# Altium project 0020-03_FFT2G.PrjPcb (part 1 of 5)
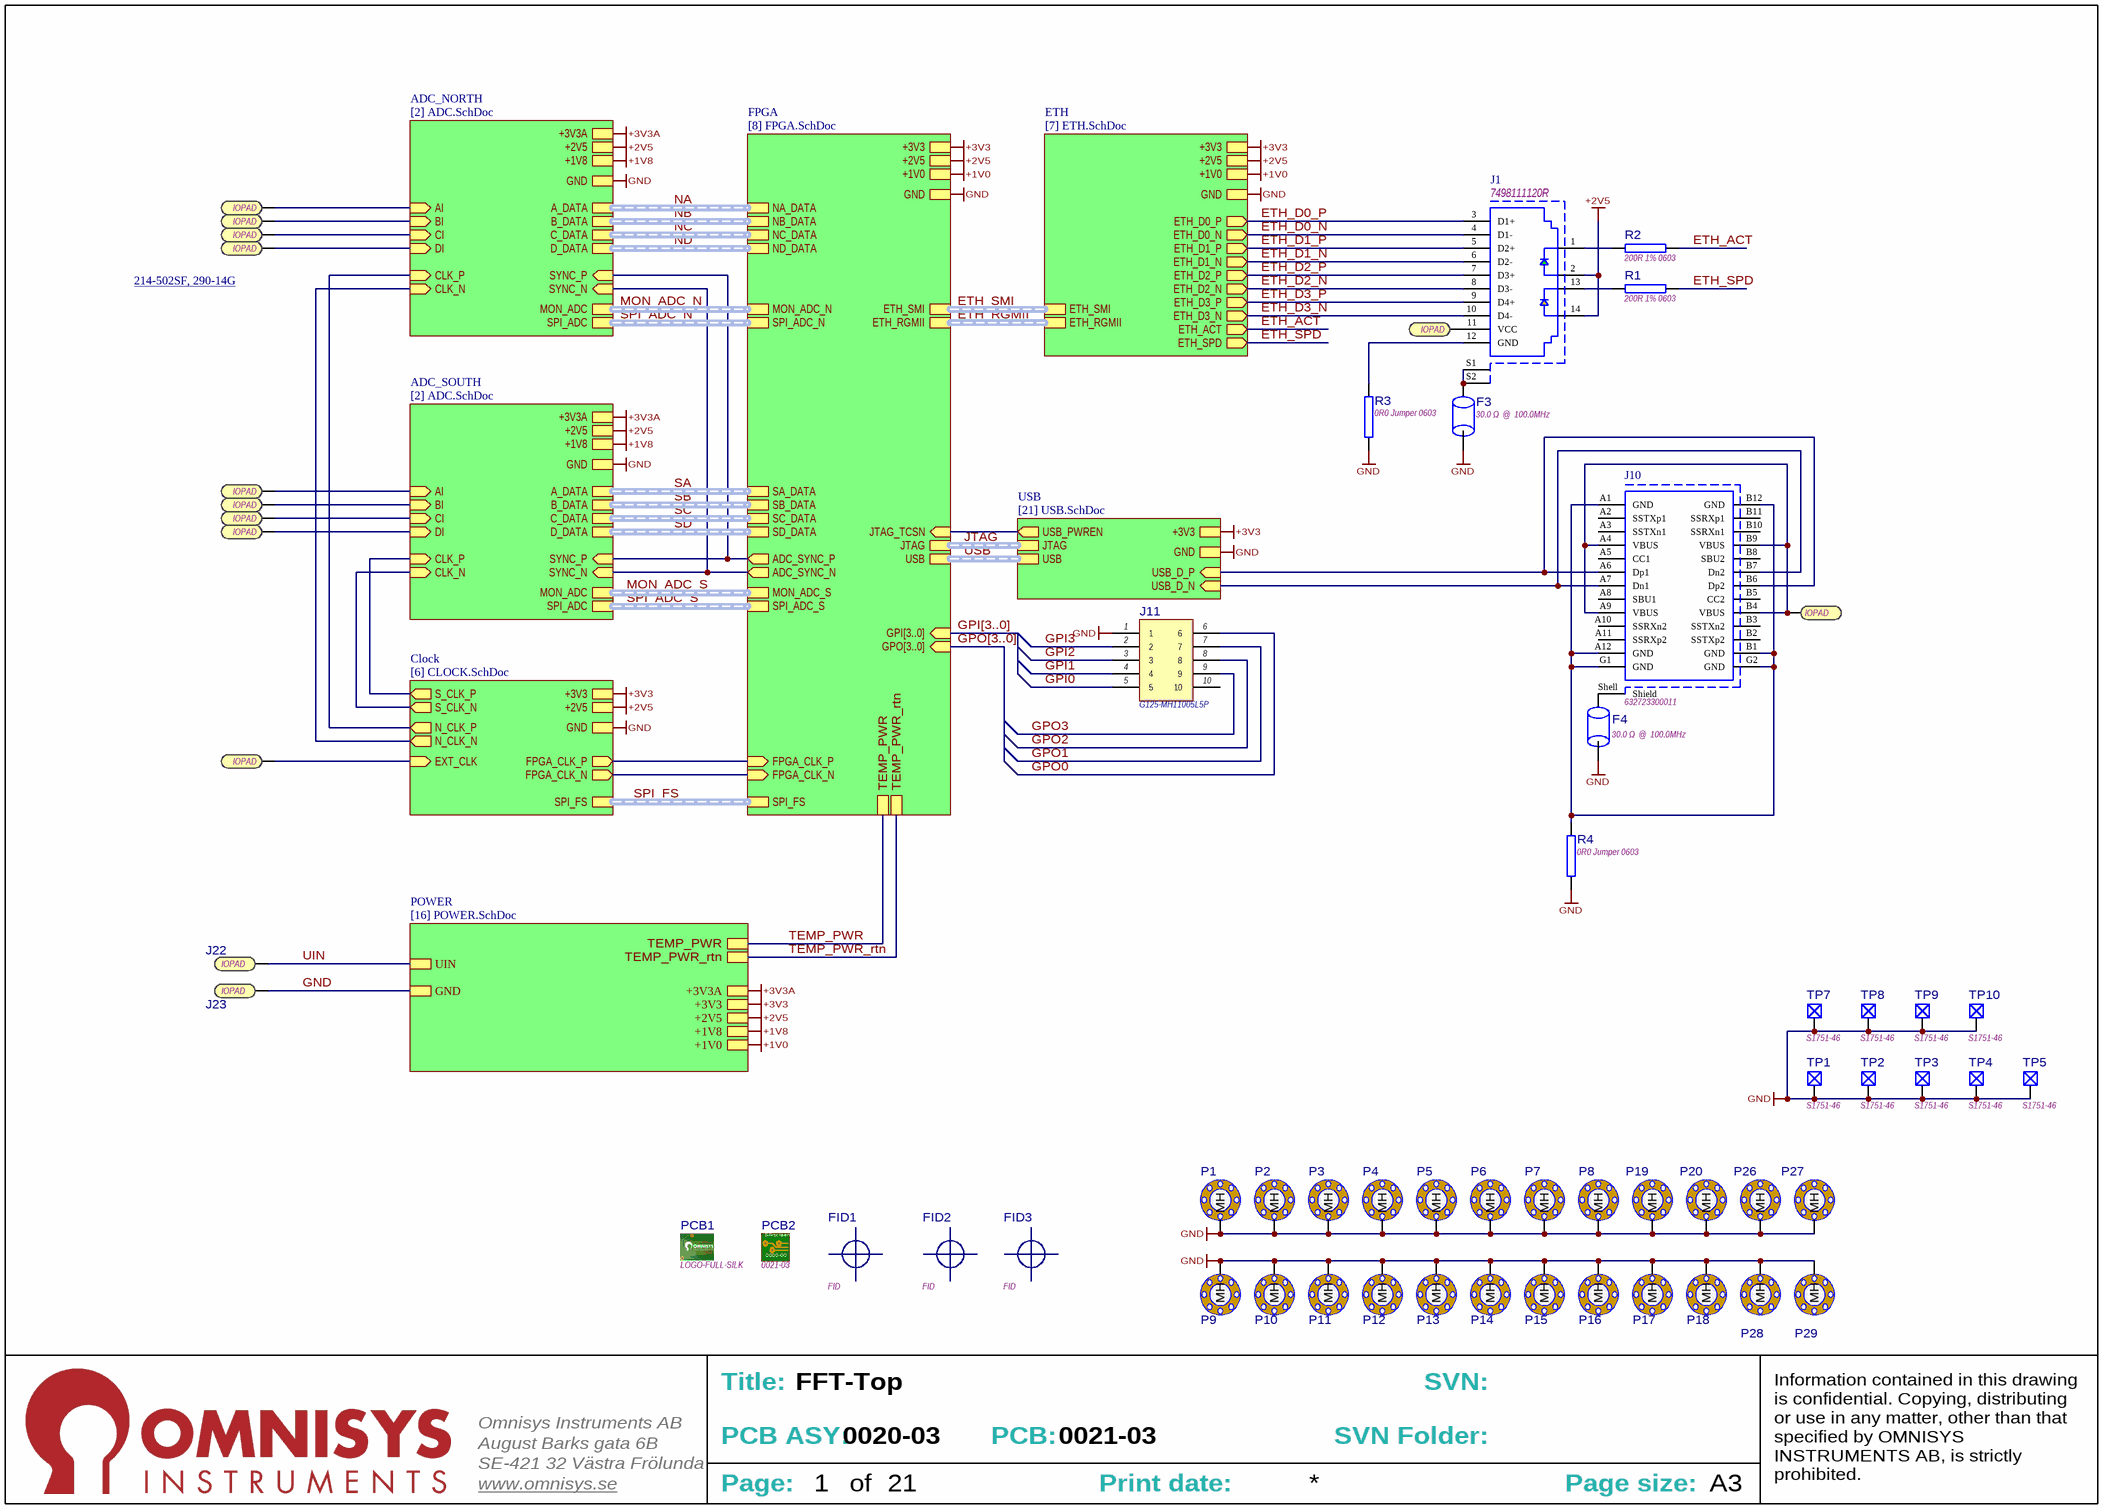
[diagram p0: [1] 0020-03_FFT2G - Top.SchDoc]
PCB_Part: 0021-03; PCBASY_Part: 0020-03
16 sheets, 515 parts. Net scope: strictly hierarchical (ports join the sheet entries above them; power ports are local).
Board file: 0020-03_FFT2G.PcbDoc
Sheets:
  [1] 0020-03_FFT2G - Top.SchDoc
    Clock = [6] CLOCK.SchDoc
    USB = [21] USB.SchDoc
    FPGA = [8] FPGA.SchDoc
      FPGA_ADC_N = [9] FPGA_ADC_N.SchDoc
      FPGA_ADC_S = [10] FPGA_ADC_S.SchDoc
      FPGA_MONITOR = [12] FPGA_MONITOR.SchDoc
      FPGA_UNUSED = [15] FPGA_UNUSED.SchDoc
      FPGA_CONFIG = [11] FPGA_CONFIG.SchDoc
    ETH = [7] ETH.SchDoc
    POWER = [16] POWER.SchDoc
      Ch_A 1.0V = [19] Switching Regulator Module.SchDoc
      Power-Filter-LDO = [17] POWER-FILTER_LDO.SchDoc
      Ch_B 2.5V = [19] Switching Regulator Module.SchDoc
      Ch_C 2.3V = [19] Switching Regulator Module.SchDoc
      Ch_D 3.8V = [19] Switching Regulator Module.SchDoc
  [3] ADC_INPUT_BIAS.SchDoc
  [4] ADC_DECOUPLING.SchDoc
  [5] ADC_CURRENT_PUMP.SchDoc

## Sheet [1] 0020-03_FFT2G - Top.SchDoc: FFT-Top
size 393 x 281 mm; Notes: No notes; Part_And_Rev: 0000-00; Drawing_Configuration: No Configuration; SheetNumber: 1; SheetTotal: 21; CompanyName: Omnisys Instruments AB; DrawnBy: Enter Name; PageSetup: Record=PageOptions|CenterHorizontal=True|CenterVertical=True|PrintScale=0.94|XCorrection=0.00|YCorrection=0.00|PrintKind=0|BorderSize=5000000|LeftOffset=0|BottomOffset=0|Orientation=2|PaperLength=1000|PaperWidth=1000|Scale=100|PaperSource=15|PrintQuality=-3|MediaType=1|DitherType=10|PrintScaleMode=1|PaperKind=10" x 14"|PaperIndex=16; Adr1: August Barks gata 6B; Adr2: SE-421 32 Västra Frölunda; Adr3: Sweden; Webpage: www.omnisys.se

### Parts
F3  30.0 Ω  @  100.0MHz  [INDC2012X11N]
F4  30.0 Ω  @  100.0MHz  [INDC2012X11N]
FID1  FID  [FID]
FID2  FID  [FID]
FID3  FID  [FID]
J1  7498111120R  [7498111120R-Footprint-1]
J2  IOPAD  [SMT_IO_PAD_0.5x0.5MM]  (no BOM)
J3  IOPAD  [SMT_IO_PAD_0.5x0.5MM]  (no BOM)
J4  IOPAD  [SMT_IO_PAD_0.5x0.5MM]  (no BOM)
J5  IOPAD  [SMT_IO_PAD_0.5x0.5MM]  (no BOM)
J6  IOPAD  [SMT_IO_PAD_0.5x0.5MM]  (no BOM)
J7  IOPAD  [SMT_IO_PAD_0.5x0.5MM]  (no BOM)
J8  IOPAD  [SMT_IO_PAD_0.5x0.5MM]  (no BOM)
J9  IOPAD  [SMT_IO_PAD_0.5x0.5MM]  (no BOM)
J10  632723300011  [632723300011]
J11  G125-MH11005L5P  [G125-MH11005L5P-Footprint-1]
J15  IOPAD  [SMT_IO_PAD_0.5x0.5MM]  (no BOM)
J17  IOPAD  [SMT_IO_PAD_2x1MM]  (no BOM)
J18  IOPAD  [SMT_IO_PAD_2x1MM]  (no BOM)
J22  IOPAD  [SMT_IO_PAD_4x2MM]  (no BOM)
J23  IOPAD  [SMT_IO_PAD_4x2MM]  (no BOM)
P1  M2.5-6.3mm pad  [MH6.3-2_7MM]  (value not drawn)  (no BOM)
P2  M2.5-6.3mm pad  [MH6.3-2_7MM]  (value not drawn)  (no BOM)
P3  M2.5-6.3mm pad  [MH6.3-2_7MM]  (value not drawn)  (no BOM)
P4  M2.5-6.3mm pad  [MH6.3-2_7MM]  (value not drawn)  (no BOM)
P5  M2.5-6.3mm pad  [MH6.3-2_7MM]  (value not drawn)  (no BOM)
P6  M2.5-6.3mm pad  [MH6.3-2_7MM]  (value not drawn)  (no BOM)
P7  M2.5-6.3mm pad  [MH6.3-2_7MM]  (value not drawn)  (no BOM)
P8  M2.5-6.3mm pad  [MH6.3-2_7MM]  (value not drawn)  (no BOM)
P9  M2.5-6.3mm pad  [MH6.3-2_7MM]  (value not drawn)  (no BOM)
P10  M2.5-6.3mm pad  [MH6.3-2_7MM]  (value not drawn)  (no BOM)
P11  M2.5-6.3mm pad  [MH6.3-2_7MM]  (value not drawn)  (no BOM)
P12  M2.5-6.3mm pad  [MH6.3-2_7MM]  (value not drawn)  (no BOM)
P13  M2.5-6.3mm pad  [MH6.3-2_7MM]  (value not drawn)  (no BOM)
P14  M2.5-6.3mm pad  [MH6.3-2_7MM]  (value not drawn)  (no BOM)
P15  M2.5-6.3mm pad  [MH6.3-2_7MM]  (value not drawn)  (no BOM)
P16  M2.5-6.3mm pad  [MH6.3-2_7MM]  (value not drawn)  (no BOM)
P17  M2.5-6.3mm pad  [MH6.3-2_7MM]  (value not drawn)  (no BOM)
P18  M2.5-6.3mm pad  [MH6.3-2_7MM]  (value not drawn)  (no BOM)
P19  M2.5-6.3mm pad  [MH6.3-2_7MM]  (value not drawn)  (no BOM)
P20  M2.5-6.3mm pad  [MH6.3-2_7MM]  (value not drawn)  (no BOM)
P26  M2.5-6.3mm pad  [MH6.3-2_7MM]  (value not drawn)  (no BOM)
P27  M2.5-6.3mm pad  [MH6.3-2_7MM]  (value not drawn)  (no BOM)
P28  M2.5-6.3mm pad  [MH6.3-2_7MM]  (value not drawn)  (no BOM)
P29  M2.5-6.3mm pad  [MH6.3-2_7MM]  (value not drawn)  (no BOM)
PCB1  LOGO-FULL-SILK  [LOGO-FULL-SILK]  (no BOM)
PCB2  0021-03  [PCBNo_SILK]
R1  200R 1% 0603  [RESC1608N]
R2  200R 1% 0603  [RESC1608N]
R3  0R0 Jumper 0603  [RESC1608N]
R4  0R0 Jumper 0603  [RESC1608N]
TP1  S1751-46  [S1751-46]
TP2  S1751-46  [S1751-46]
TP3  S1751-46  [S1751-46]
TP4  S1751-46  [S1751-46]
TP5  S1751-46  [S1751-46]
TP7  S1751-46  [S1751-46]
TP8  S1751-46  [S1751-46]
TP9  S1751-46  [S1751-46]
TP10  S1751-46  [S1751-46]

### Sub-sheets
ADC_NORTH = [2] ADC.SchDoc (file not in this document): SYNC_P (in), SYNC_N (in), CLK_P (in), CLK_N (in), A_DATA (harness ADC Port), B_DATA (harness ADC Port), C_DATA (harness ADC Port), D_DATA (harness ADC Port), DI (in), AI (in), BI (in), CI (in), SPI_ADC (harness SPI_ADC), +3V3A, GND, +1V8, MON_ADC (harness MON_ADC), +2V5
ADC_SOUTH = [2] ADC.SchDoc (file not in this document): SYNC_P (in), SYNC_N (in), CLK_P (in), CLK_N (in), A_DATA (harness ADC Port), B_DATA (harness ADC Port), C_DATA (harness ADC Port), D_DATA (harness ADC Port), DI (in), AI (in), BI (in), CI (in), SPI_ADC (harness SPI_ADC), +3V3A, GND, +1V8, MON_ADC (harness MON_ADC), +2V5
Clock = [6] CLOCK.SchDoc: EXT_CLK (in), N_CLK_P (out), N_CLK_N (out), S_CLK_P (out), S_CLK_N (out), +3V3, +2V5, GND, SPI_FS (harness SPI_FS), FPGA_CLK_P (out), FPGA_CLK_N (out)
ETH = [7] ETH.SchDoc: +2V5, +1V0, GND, +3V3, ETH_SMI (harness ETH_SMI), ETH_D3_P (out), ETH_D2_P (out), ETH_D2_N (out), ETH_D3_N (out), ETH_D0_N (out), ETH_RGMII (harness ETH_RGMII), ETH_D1_P (out), ETH_D0_P (out), ETH_D1_N (out), ETH_SPD (out), ETH_ACT (out)
FPGA = [8] FPGA.SchDoc: NA_DATA (harness ADC Port), NB_DATA (harness ADC Port), NC_DATA (harness ADC Port), SA_DATA (harness ADC Port), ND_DATA (harness ADC Port), SB_DATA (harness ADC Port), SC_DATA (harness ADC Port), SD_DATA (harness ADC Port), ADC_SYNC_P (out), ADC_SYNC_N (out), +1V0, GND, +2V5, +3V3, MON_ADC_S (harness MON_ADC), MON_ADC_N (harness MON_ADC), FPGA_CLK_N (in), FPGA_CLK_P (in), SPI_FS (harness SPI_FS), SPI_ADC_S (harness SPI_ADC), SPI_ADC_N (harness SPI_ADC), JTAG (harness USB JTAG), JTAG_TCSN (in), USB (harness USB FIFO), GPI[3..0] (in), ETH_SMI (harness ETH_SMI), ETH_RGMII (harness ETH_RGMII), GPO[3..0] (in), TEMP_PWR_rtn, TEMP_PWR
POWER = [16] POWER.SchDoc: +3V3A, +3V3, +2V5, +1V8, +1V0, UIN, GND, TEMP_PWR_rtn, TEMP_PWR
USB = [21] USB.SchDoc: USB_PWREN (out), USB_D_N (in), USB_D_P (in), JTAG (harness USB JTAG), USB (harness USB FIFO), +3V3, GND

### Nets
+1V0: sheet FPGA/+1V0, sheet ETH/+1V0, sheet POWER/+1V0
+1V8: sheet ADC_SOUTH/+1V8, sheet ADC_NORTH/+1V8, sheet POWER/+1V8
+2V5: J1.2 J1.14 ; sheet ADC_SOUTH/+2V5, sheet Clock/+2V5, sheet FPGA/+2V5, sheet ADC_NORTH/+2V5, sheet ETH/+2V5, sheet POWER/+2V5
+3V3: sheet Clock/+3V3, sheet USB/+3V3, sheet FPGA/+3V3, sheet ETH/+3V3, sheet POWER/+3V3
+3V3A: sheet ADC_SOUTH/+3V3A, sheet ADC_NORTH/+3V3A, sheet POWER/+3V3A
GND: F3.1 F4.1 J11.1 J23.1 P1.MH P2.MH P3.MH P4.MH P5.MH P6.MH P7.MH P8.MH P9.MH P10.MH P11.MH P12.MH P13.MH P14.MH P15.MH P16.MH P17.MH P18.MH P19.MH P20.MH P26.MH P27.MH P28.MH P29.MH R3.1 R4.1 TP1.1 TP2.1 TP3.1 TP4.1 TP5.1 TP7.1 TP8.1 TP9.1 TP10.1 ; sheet ADC_SOUTH/GND, sheet Clock/GND, sheet USB/GND, sheet FPGA/GND, sheet ADC_NORTH/GND, sheet ETH/GND, sheet POWER/GND
ADC_SYNC_N: sheet ADC_SOUTH/SYNC_N, sheet FPGA/ADC_SYNC_N, sheet ADC_NORTH/SYNC_N
ADC_SYNC_P: sheet ADC_SOUTH/SYNC_P, sheet FPGA/ADC_SYNC_P, sheet ADC_NORTH/SYNC_P
ETH_ACT: R2.2 ; sheet ETH/ETH_ACT
ETH_D0_N: J1.4(D1-) ; sheet ETH/ETH_D0_N
ETH_D0_P: J1.3(D1+) ; sheet ETH/ETH_D0_P
ETH_D1_N: J1.6(D2-) ; sheet ETH/ETH_D1_N
ETH_D1_P: J1.5(D2+) ; sheet ETH/ETH_D1_P
ETH_D2_N: J1.8(D3-) ; sheet ETH/ETH_D2_N
ETH_D2_P: J1.7(D3+) ; sheet ETH/ETH_D2_P
ETH_D3_N: J1.10(D4-) ; sheet ETH/ETH_D3_N
ETH_D3_P: J1.9(D4+) ; sheet ETH/ETH_D3_P
ETH_SPD: R1.2 ; sheet ETH/ETH_SPD
FPGA_CLK_N: sheet Clock/FPGA_CLK_N, sheet FPGA/FPGA_CLK_N
FPGA_CLK_P: sheet Clock/FPGA_CLK_P, sheet FPGA/FPGA_CLK_P
GPI0: J11.5
GPI1: J11.4
GPI2: J11.3
GPI3: J11.2
GPO0: J11.6
GPO1: J11.7
GPO2: J11.8
GPO3: J11.9
N_CLK_N: sheet Clock/N_CLK_N, sheet ADC_NORTH/CLK_N
N_CLK_P: sheet Clock/N_CLK_P, sheet ADC_NORTH/CLK_P
S_CLK_N: sheet ADC_SOUTH/CLK_N, sheet Clock/S_CLK_N
S_CLK_P: sheet ADC_SOUTH/CLK_P, sheet Clock/S_CLK_P
TEMP_PWR: sheet FPGA/TEMP_PWR, sheet POWER/TEMP_PWR
TEMP_PWR_rtn: sheet FPGA/TEMP_PWR_rtn, sheet POWER/TEMP_PWR_rtn
UIN: J22.1 ; sheet POWER/UIN
USB_D_N: J10.A7(Dn1) J10.B7(Dn2) ; sheet USB/USB_D_N
USB_D_P: J10.A6(Dp1) J10.B6(Dp2) ; sheet USB/USB_D_P
USB_PWREN: sheet USB/USB_PWREN, sheet FPGA/JTAG_TCSN
NetC34_1: J15.1 ; sheet Clock/EXT_CLK
NetF3_2: F3.2 J1.S1(Shield) J1.S2(Shield)
NetF4_2: F4.2 J10.Shell(Shield)
NetJ1_1: J1.1 R2.1
NetJ1_11: J1.11(VCC) J17.1
NetJ1_12: J1.12(GND) R3.2
NetJ1_13: J1.13 R1.1
NetJ2_1: J2.1 ; sheet ADC_NORTH/AI
NetJ3_1: J3.1 ; sheet ADC_NORTH/BI
NetJ4_1: J4.1 ; sheet ADC_NORTH/CI
NetJ5_1: J5.1 ; sheet ADC_NORTH/DI
NetJ6_1: J6.1 ; sheet ADC_SOUTH/AI
NetJ7_1: J7.1 ; sheet ADC_SOUTH/BI
NetJ8_1: J8.1 ; sheet ADC_SOUTH/CI
NetJ9_1: J9.1 ; sheet ADC_SOUTH/DI
NetJ10_A1: J10.A1(GND) J10.A12(GND) J10.B1(GND) J10.B12(GND) J10.G1(GND) J10.G2(GND) R4.2
NetJ10_A4: J10.A4(VBUS) J10.A9(VBUS) J10.B4(VBUS) J10.B9(VBUS) J18.1

Not connected (* = marked no-connect by the designer): J10 A2(SSTXp1) A3(SSTXn1) A5(CC1) A8(SBU1) A10(SSRXn2) A11(SSRXp2) B2(SSTXp2) B3(SSTXn2) B5(CC2) B8(SBU2) B10(SSRXn1) B11(SSRXp1); J11 10

### Buses and harness runs
bus GPI[3..0] = sheet FPGA/GPI[3..0]
bus GPO[3..0] = sheet FPGA/GPO[3..0]
harness ETH_RGMII = sheet ETH/ETH_RGMII = sheet FPGA/ETH_RGMII
harness ETH_SMI = sheet ETH/ETH_SMI = sheet FPGA/ETH_SMI
harness JTAG = sheet FPGA/JTAG = sheet USB/JTAG
harness MON_ADC_N = sheet ADC_NORTH/MON_ADC = sheet FPGA/MON_ADC_N
harness MON_ADC_S = sheet ADC_SOUTH/MON_ADC = sheet FPGA/MON_ADC_S
harness NA = sheet ADC_NORTH/A_DATA = sheet FPGA/NA_DATA
harness NB = sheet ADC_NORTH/B_DATA = sheet FPGA/NB_DATA
harness NC = sheet ADC_NORTH/C_DATA = sheet FPGA/NC_DATA
harness ND = sheet ADC_NORTH/D_DATA = sheet FPGA/ND_DATA
harness SA = sheet ADC_SOUTH/A_DATA = sheet FPGA/SA_DATA
harness SB = sheet ADC_SOUTH/B_DATA = sheet FPGA/SB_DATA
harness SC = sheet ADC_SOUTH/C_DATA = sheet FPGA/SC_DATA
harness SD = sheet ADC_SOUTH/D_DATA = sheet FPGA/SD_DATA
harness SPI_ADC_N = sheet ADC_NORTH/SPI_ADC = sheet FPGA/SPI_ADC_N
harness SPI_ADC_S = sheet ADC_SOUTH/SPI_ADC = sheet FPGA/SPI_ADC_S
harness SPI_FS = sheet Clock/SPI_FS = sheet FPGA/SPI_FS
harness USB = sheet FPGA/USB = sheet USB/USB

### Notes on the sheet
- 214-502SF, 290-14G <https://mpd.southwestmicrowave.com/product/214-502sf-supersma-jack-female-2-hole-625-long/>
- Title:
- SVN:
- August Barks gata 6B
- SE-421 32 Västra Frölunda
- Omnisys Instruments AB
- PCB ASY:
- PCB:
- SVN Folder:
- www.omnisys.se
- Page:
- of
- Print date:
- Page size:
- A3
- Information contained in this drawing is confidential. Copying, distributing or use in any matter, other than that specified by OMNISYS INSTRUMENTS AB, is strictly prohibited.
- (in symbol CMP-4700-000000-3) Silkscreen; 0000-00

### Library data of the parts
F3 F4 = CMP-0600-000010-2: Ferrite bead, Würth Elektronik WE-CBF 2012 (0805), 74279206 ,  30.0 Ω  @  100.0MHz; Zmax@Freq: 55.0 Ω  @      1.0 GHz; Type: High Current; RDC: 25.0 mΩ; IDC: 3.0 A; Z@Freq: 30.0 Ω  @  100.0MHz; PartNumber: 74279206
FID1-FID3 = CMP-1600-000001-2: Pick and place fiducial
J1 = CMP-1000-000522-2: CONN MAGJACK 1PORT 1000 BASE-T; PartNumber: 7498111120AR; Pitch: 2.54mm; Gender: Female; Number of Positions: 8; Shielding: Shielded; Direction: Up; Number of Ports: 1; Connector Type: RJ45; Mount: Surface Mount,Edge; Color: Green,Yellow,Black; Contact Plating: Gold; Housing Material: Polymer; Package Quantity: 100; Max Operating Temperature: 70°C; Number of Rows: 1; Termination: SMD/SMT; Packaging: Tape and Reel; Mounting type: SMD; Lead Free: Lead Free; Number of Cores per Jack: 8; Min Operating Temperature: 0°C; REACH SVHC: Unknown; Number of Contacts: 8; Rows: 1; Pins: 14; Contact Material: Bronze
J2-J9 J15 = CMP-1000-000525-1: Square IO pad 0.5x0.5mm used for test points and flying leads.
J10 = CMP-1502-03214-1: USB 3.1 Type C Receptacle WR-COM, Horizontal, SMT / THT; Manufacturer: Wurth Elektronik; Rated Current: 5A; Contact Resistance: 30mOhm; Working Voltage: 20VDC; Operating Temperature: -40to105degC; Package Reference: 632723300011; Datasheet URL: https://katalog.we-online.de/em/datasheet/632723x00011%282%29.pdf; Manufacturer URL: http://www.we-online.de; Connector Type: USB3.1TypeC; Gender: Receptacle; Part Number: 632723300011; Mounting Technology: SMT/THT; Publisher: WurthElektronik; Packaging: TapeandReel; Orientation: Horizontal
J11 = CMP-1000-000523-2: CONN HDR 1.25MM R/A PCB 10POS; Row Spacing: 0.049inch; Number of Positions: 10; Rows: 2; Connector Type: Male Pin; Contact Plating: Gold; Number of Rows: 2; Number of Pins: 10; Mount: Through Hole; Color: Green; Termination: Solder; Pins: 10; Pitch: 0.049inch; Packaging: Cut Strip
J17 J18 J22 J23 = CMP-1000-000152-5: IO pad used for test points and flying leads.
P1-P20 P26-P29 = CMP-1600-000026-1: Mounting hole, M2.5-6.3mm pad
PCB1 = CMP-4700-000008-1: Full logo in Silkscreen
PCB2 = CMP-4700-000000-3: PCB part number, silkscreen layer
R1 R2 = CMP-1800-002005-5: Thick film Chip Resistor, 0603/1608; Value: 200; Power: 100mW; Maximum working voltage: 75V; Temp. Coefficent: 0.01%; Tolerance: 1%; Case/Package: 0603/1608; Composition: Thick film
R3 R4 = CMP-1800-001949-5: Thick film Chip Resistor, 0603/1608; Value: 0; Tolerance: 0%; Power: 0W; Maximum working voltage: 75V; Temp. Coefficent: 0%; Case/Package: 0603/1608; Composition: Thick film
TP1-TP5 TP7-TP10 = CMP-3600-000004-2: SMD Test point clip; PartNumber: S1751-46

## Sheet [6] CLOCK.SchDoc: Clock
size 393 x 281 mm; SheetNumber: 6; SheetTotal: 21; PageSetup: Record=PageOptions|CenterHorizontal=True|CenterVertical=True|PrintScale=0.94|XCorrection=0.00|YCorrection=0.00|PrintKind=0|BorderSize=5000000|LeftOffset=0|BottomOffset=0|Orientation=2|PaperLength=1000|PaperWidth=1000|Scale=100|PaperSource=15|PrintQuality=600|MediaType=1|DitherType=10|PrintScaleMode=1|PaperKind=A4; Adr1: August Barks gata 6B; Adr2: SE-421 32 Västra Frölunda; Adr3: Sweden; Webpage: www.omnisys.se
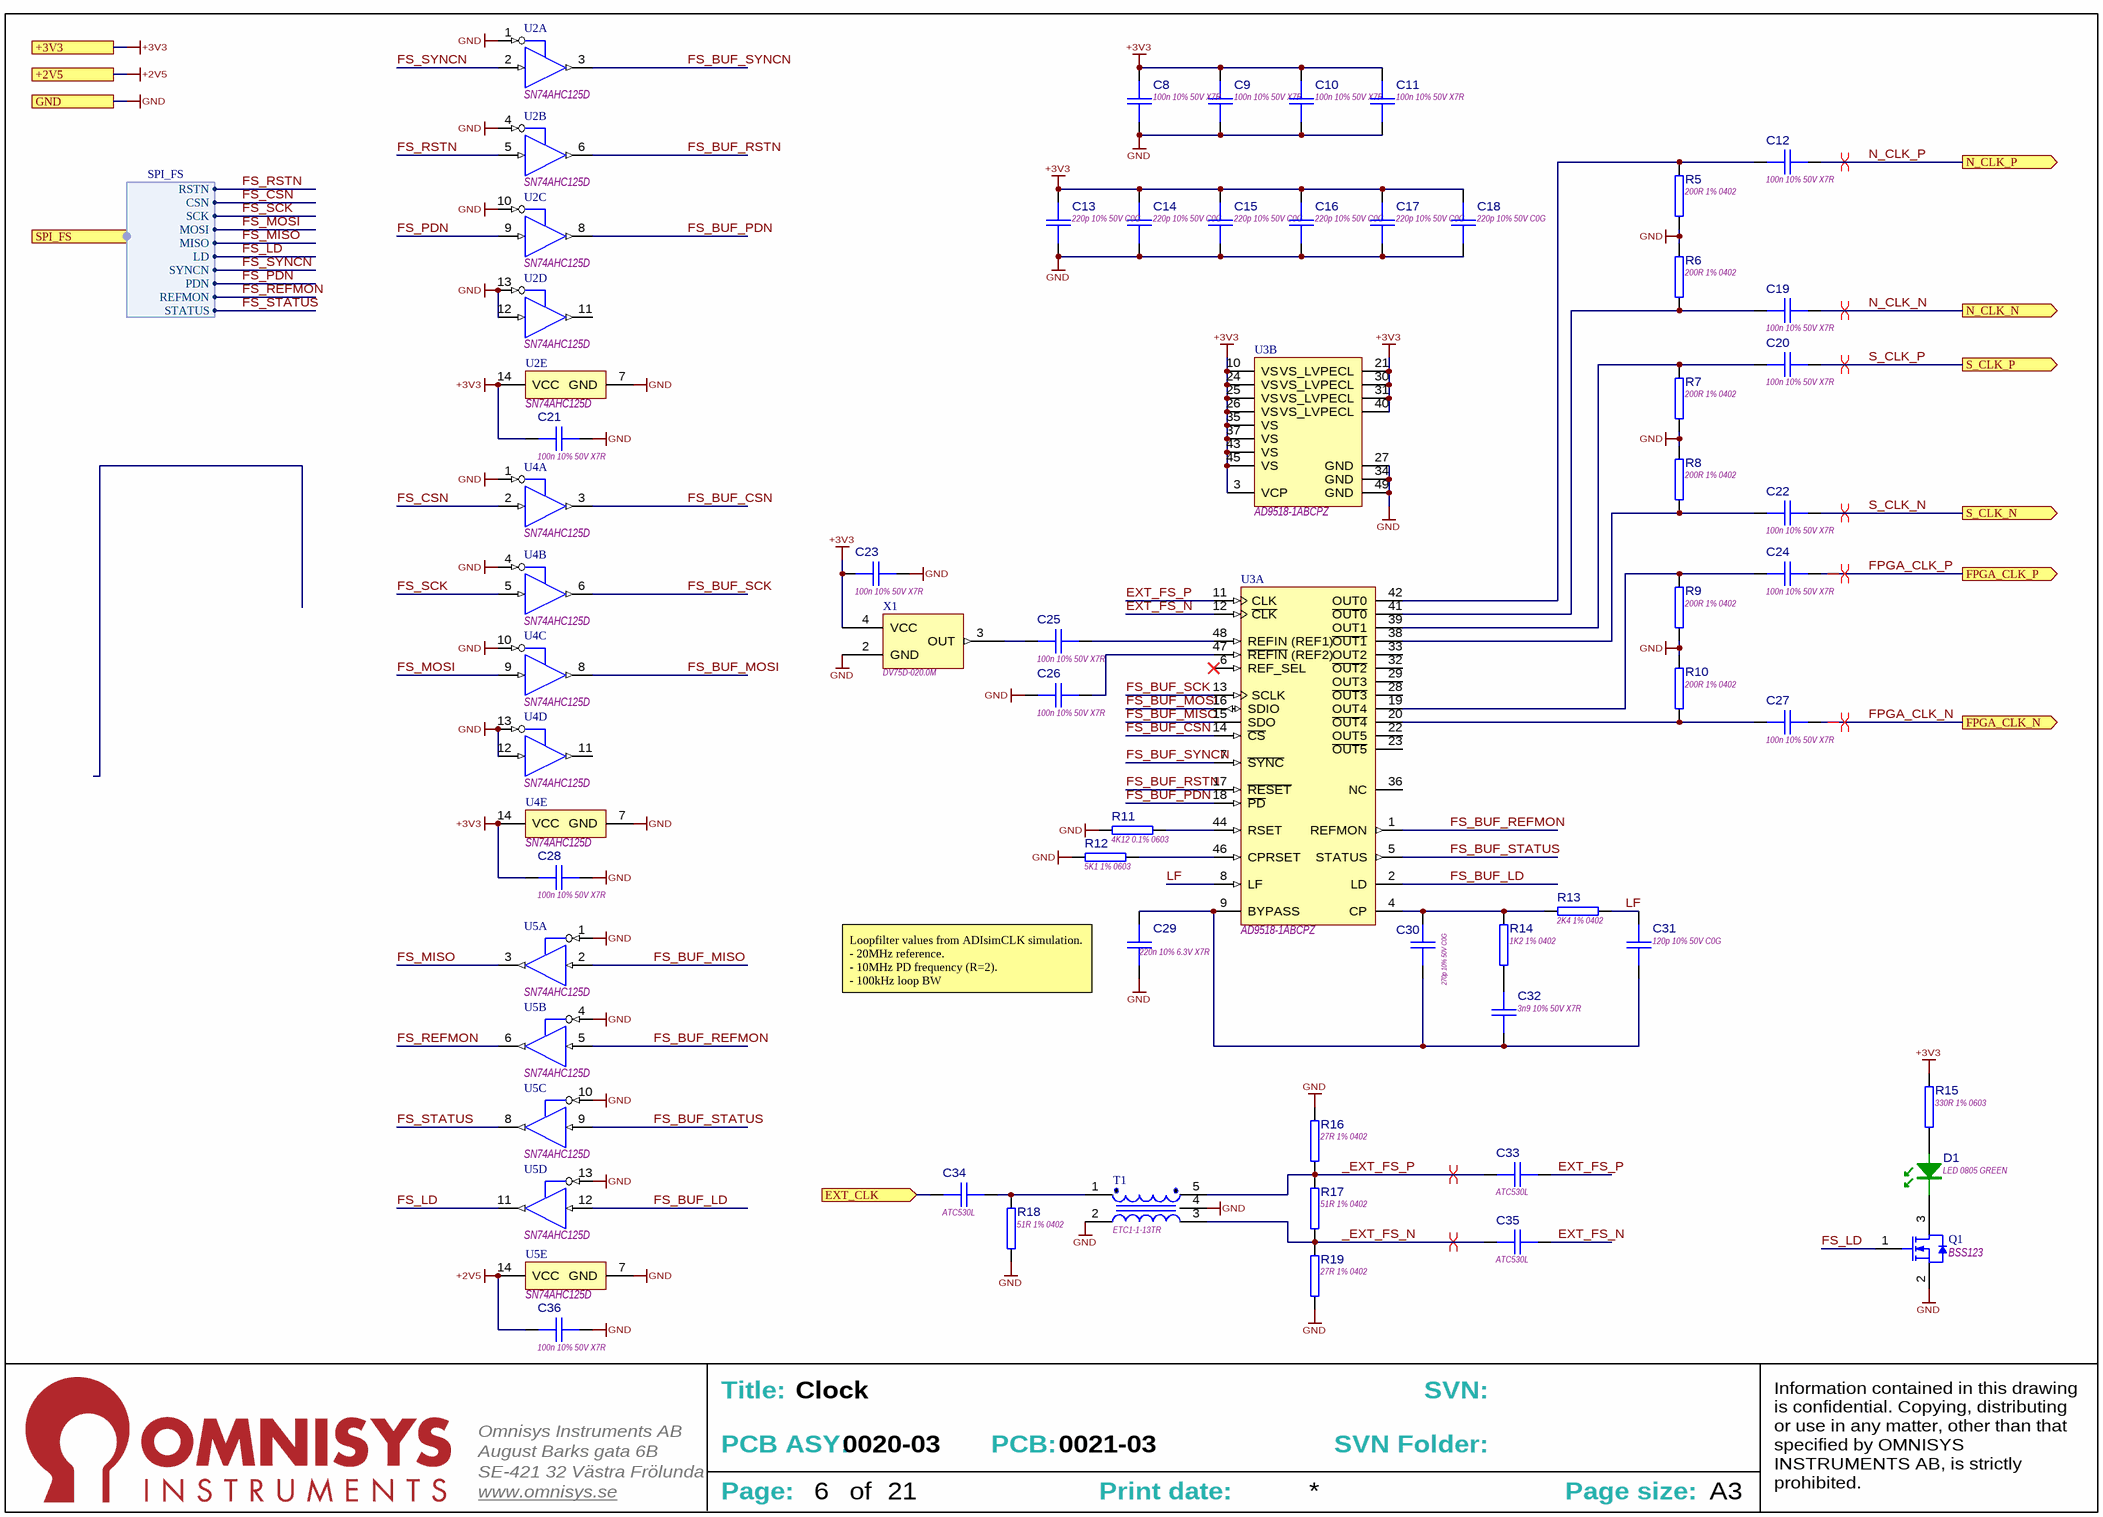
[diagram p1: [6] CLOCK.SchDoc]

### Parts
C8  100n 10% 50V X7R  [CAPC1608X90N]
C9  100n 10% 50V X7R  [CAPC1608X90N]
C10  100n 10% 50V X7R  [CAPC1608X90N]
C11  100n 10% 50V X7R  [CAPC1608X90N]
C12  100n 10% 50V X7R  [CAPC1005X55L]
C13  220p 10% 50V C0G  [CAPC1005X55N]
C14  220p 10% 50V C0G  [CAPC1005X55N]
C15  220p 10% 50V C0G  [CAPC1005X55N]
C16  220p 10% 50V C0G  [CAPC1005X55N]
C17  220p 10% 50V C0G  [CAPC1005X55N]
C18  220p 10% 50V C0G  [CAPC1005X55N]
C19  100n 10% 50V X7R  [CAPC1005X55L]
C20  100n 10% 50V X7R  [CAPC1005X55L]
C21  100n 10% 50V X7R  [CAPC1608X90N]
C22  100n 10% 50V X7R  [CAPC1005X55L]
C23  100n 10% 50V X7R  [CAPC1608X90N]
C24  100n 10% 50V X7R  [CAPC1005X55L]
C25  100n 10% 50V X7R  [CAPC1005X55L]
C26  100n 10% 50V X7R  [CAPC1005X55L]
C27  100n 10% 50V X7R  [CAPC1005X55L]
C28  100n 10% 50V X7R  [CAPC1608X90N]
C29  220n 10% 6.3V X7R  [CAPC1608X90L]
C30  270p 10% 50V C0G  [CAPC1005X55L]
C31  120p 10% 50V C0G  [CAPC1005X55L]
C32  3n9 10% 50V X7R  [CAPC1005X55L]
C33  ATC530L  [CAPC1005X06L]
C34  ATC530L  [CAPC1005X06L]
C35  ATC530L  [CAPC1005X06L]
C36  100n 10% 50V X7R  [CAPC1608X90N]
D1  LED 0805 GREEN  [LED2012-GREEN]
Q1  BSS123  [SOT95P230X110-3N]
R5  200R 1% 0402  [RESC1005L]
R6  200R 1% 0402  [RESC1005L]
R7  200R 1% 0402  [RESC1005L]
R8  200R 1% 0402  [RESC1005L]
R9  200R 1% 0402  [RESC1005L]
R10  200R 1% 0402  [RESC1005L]
R11  4K12 0.1% 0603  [RESC1608N]
R12  5K1 1% 0603  [RESC1608N]
R13  2K4 1% 0402  [RESC1005L]
R14  1K2 1% 0402  [RESC1005L]
R15  330R 1% 0603  [RESC1608N]
R16  27R 1% 0402  [RESC1005L]
R17  51R 1% 0402  [RESC1005L]
R18  51R 1% 0402  [RESC1005L]
R19  27R 1% 0402  [RESC1005L]
T1  ETC1-1-13TR  [SOTFL50P160X73-3N]
U2  SN74AHC125D  [SOIC127P600X175-14N]  (parts A,B,C,D,E of 5)
U3  AD9518-1ABCPZ  [ADI-CP-48-8_M]  (parts A,B of 2)
U4  SN74AHC125D  [SOIC127P600X175-14N]  (parts A,B,C,D,E of 5)
U5  SN74AHC125D  [SOIC127P600X175-14N]  (parts A,B,C,D,E of 5)
X1  DV75D-020.0M  [DV75D]

### Ports
+2V5, +3V3, EXT_CLK (in), FPGA_CLK_N (out), FPGA_CLK_P (out), GND, N_CLK_N (out), N_CLK_P (out), S_CLK_N (out), S_CLK_P (out), SPI_FS (harness SPI_FS)

### Harnesses
SPI_FS: CSN, MOSI, SCK, MISO, RSTN, LD, SYNCN, PDN, REFMON, STATUS

### Nets
+2V5: C36.2 U5.14(VCC) ; port +2V5
+3V3: C8.2 C9.2 C10.2 C11.2 C13.2 C14.2 C15.2 C16.2 C17.2 C18.2 C21.2 C23.2 C28.2 R15.2 U2.14(VCC) U3.3(VCP) U3.10(VS) U3.21(VS_LVPECL) U3.24(VS) U3.25(VS) U3.26(VS) U3.30(VS_LVPECL) U3.31(VS_LVPECL) U3.35(VS) U3.37(VS) U3.40(VS_LVPECL) U3.43(VS) U3.45(VS) U4.14(VCC) X1.4(VCC) ; port +3V3
GND: C8.1 C9.1 C10.1 C11.1 C13.1 C14.1 C15.1 C16.1 C17.1 C18.1 C21.1 C23.1 C26.2 C28.1 C29.2 C36.1 Q1.2(S) R5.2 R6.2 R7.2 R8.2 R9.2 R10.2 R11.1 R12.1 R16.2 R18.2 R19.2 T1.2(Primary) T1.4(NC) U2.1(1OE#) U2.4(2OE#) U2.7(GND) U2.10(3OE#) U2.12(4A) U2.13(4OE#) U3.27(GND) U3.34(GND) U3.49(GND) U4.1(1OE#) U4.4(2OE#) U4.7(GND) U4.10(3OE#) U4.12(4A) U4.13(4OE#) U5.1(1OE#) U5.4(2OE#) U5.7(GND) U5.10(3OE#) U5.13(4OE#) X1.2(GND) ; port GND
_EXT_FS_N: C35.1 R17.1 R19.1 T1.3(Secondary)
_EXT_FS_P: C33.1 R16.1 R17.2 T1.5(Secondary_dot)
EXT_FS_N: C35.2 U3.12(~{CLK})
EXT_FS_P: C33.2 U3.11(CLK)
FPGA_CLK_N: C27.1 ; port FPGA_CLK_N
FPGA_CLK_P: C24.1 ; port FPGA_CLK_P
FS_BUF_CSN: U3.14(~{CS}) U4.3(1Y)
FS_BUF_LD: U3.2(LD) U5.12(4A)
FS_BUF_MISO: U3.15(SDO) U5.2(1A)
FS_BUF_MOSI: U3.16(SDIO) U4.8(3Y)
FS_BUF_PDN: U2.8(3Y) U3.18(~{PD})
FS_BUF_REFMON: U3.1(REFMON) U5.5(2A)
FS_BUF_RSTN: U2.6(2Y) U3.17(~{RESET})
FS_BUF_SCK: U3.13(SCLK) U4.6(2Y)
FS_BUF_STATUS: U3.5(STATUS) U5.9(3A)
FS_BUF_SYNCN: U2.3(1Y) U3.7(~{SYNC})
FS_CSN: U4.2(1A) ; port SPI_FS.CSN  [project net SPI_FS.CSN]
FS_LD: Q1.1(G) U5.11(4Y) ; port SPI_FS.LD  [project net SPI_FS.LD]
FS_MISO: U5.3(1Y) ; port SPI_FS.MISO  [project net SPI_FS.MISO]
FS_MOSI: U4.9(3A) ; port SPI_FS.MOSI  [project net SPI_FS.MOSI]
FS_PDN: U2.9(3A) ; port SPI_FS.PDN  [project net SPI_FS.PDN]
FS_REFMON: U5.6(2Y) ; port SPI_FS.REFMON  [project net SPI_FS.REFMON]
FS_RSTN: U2.5(2A) ; port SPI_FS.RSTN  [project net SPI_FS.RSTN]
FS_SCK: U4.5(2A) ; port SPI_FS.SCK  [project net SPI_FS.SCK]
FS_STATUS: U5.8(3Y) ; port SPI_FS.STATUS  [project net SPI_FS.STATUS]
FS_SYNCN: U2.2(1A) ; port SPI_FS.SYNCN  [project net SPI_FS.SYNCN]
LF: C31.2 R13.2 U3.8(LF)
N_CLK_N: C19.1 ; port N_CLK_N
N_CLK_P: C12.1 ; port N_CLK_P
S_CLK_N: C22.1 ; port S_CLK_N
S_CLK_P: C20.1 ; port S_CLK_P
NetC12_2: C12.2 R5.1 U3.42(OUT0)
NetC19_2: C19.2 R6.1 U3.41(~{OUT0})
NetC20_2: C20.2 R7.1 U3.39(OUT1)
NetC22_2: C22.2 R8.1 U3.38(~{OUT1})
NetC24_2: C24.2 R9.1 U3.19(OUT4)
NetC25_1: C25.1 U3.48(REFIN_(REF1))
NetC25_2: C25.2 X1.3(OUT)
NetC26_1: C26.1 U3.47(~{REFIN}_(REF2))
NetC27_2: C27.2 R10.1 U3.20(~{OUT4})
NetC29_1: C29.1 C30.2 C31.1 C32.2 U3.9(BYPASS)
NetC30_1: C30.1 R13.1 R14.2 U3.4(CP)
NetC32_1: C32.1 R14.1
NetC34_1: C34.1 ; port EXT_CLK
NetC34_2: C34.2 R18.1 T1.1(Primary_dot)
NetD1_1: D1.1 Q1.3(D)
NetD1_2: D1.2 R15.1
NetR11_2: R11.2 U3.44(RSET)
NetR12_2: R12.2 U3.46(CPRSET)

Not connected (* = marked no-connect by the designer): U2 11(4Y); U3 6(REF_SEL)* 22(OUT5) 23(~{OUT5}) 28(~{OUT3}) 29(OUT3) 32(~{OUT2}) 33(OUT2) 36(NC); U4 11(4Y)

### Layout directives
differential pair; rule Differential Pairs Routing [Pref Gap = 0.2mm    Min Gap  = 0.2mm    Max Gap  = 0.2mmPref Width = 0.3mm    Min Width  = 0.2mm    Max Width  = 0.3mm]: N_CLK_N, N_CLK_P, S_CLK_N, S_CLK_P
differential pair: _EXT_FS_N, _EXT_FS_P
differential pair; rule Differential Pairs Routing [Pref Gap = 0.1mm    Min Gap  = 0.1mm    Max Gap  = 0.1mmPref Width = 0.1mm    Min Width  = 0.1mm    Max Width  = 0.1mm]; net class DiffPairs_FPGA_CLK: FPGA_CLK_N, FPGA_CLK_P

### Notes on the sheet
- Loopfilter values from ADIsimCLK simulation.
  - 20MHz reference.
  - 10MHz PD frequency (R=2).
  - 100kHz loop BW
- Title:
- SVN:
- August Barks gata 6B
- SE-421 32 Västra Frölunda
- Omnisys Instruments AB
- PCB ASY:
- PCB:
- SVN Folder:
- www.omnisys.se
- Page:
- of
- Print date:
- Page size:
- A3
- Information contained in this drawing is confidential. Copying, distributing or use in any matter, other than that specified by OMNISYS INSTRUMENTS AB, is strictly prohibited.

### Library data of the parts
C8-C11 C21 C23 C28 C36 = CMP-0300-002665-6: Ceramic Chip Capacitor, 0603/1608; Capacitance: 100nF; Package: 1608/0603; Temperature Charateristics: X7R; Tolerance: 10%; Rated Voltage: 50V; Thickness: 900µm; Weight: 9mg
C12 C19 C20 C22 C24-C27 = CMP-0300-002965-5: Ceramic Chip Capacitor, 0402/1005; Capacitance: 100nF; Package: 0402/1005; Temperature Charateristics: X7R; Tolerance: 10%; Thickness: 550µm; Rated Voltage: 50V
C13-C18 = CMP-0300-002795-5: Ceramic Chip Capacitor, 0402/1005; Capacitance: 220pF; Package: 0402/1005; Temperature Charateristics: C0G; Tolerance: 10%; Thickness: 550µm; Rated Voltage: 50V
C29 = CMP-0300-002106-6: Ceramic Chip Capacitor, 0603/1608; Capacitance: 220nF; Package: 1608/0603; Temperature Charateristics: X7R; Tolerance: 10%; Rated Voltage: 6.3V; Thickness: 900µm; Weight: 9mg
C30 = CMP-0300-002797-5: Ceramic Chip Capacitor, 0402/1005; Capacitance: 270pF; Package: 0402/1005; Temperature Charateristics: C0G; Tolerance: 10%; Thickness: 550µm; Rated Voltage: 50V
C31 = CMP-0300-002789-5: Ceramic Chip Capacitor, 0402/1005; Capacitance: 120pF; Package: 0402/1005; Temperature Charateristics: C0G; Tolerance: 10%; Thickness: 550µm; Rated Voltage: 50V
C32 = CMP-0300-002952-4: Ceramic Chip Capacitor, 0402/1005; Capacitance: 3.9nF; Package: 0402/1005; Temperature Charateristics: X7R; Tolerance: 10%; Thickness: 550µm; Rated Voltage: 50V
C33-C35 = CMP-0300-000000-2: 100n 16V ±15% 0402 (1005 metric) ATC530L104KT16T; Case-EIA: 0402; Case-Metric: 1005; Dielectric: X7R; OmnisysBuy: False; Maximum working voltage: 16V; Tolerance: ±15%; Technology: SMT
D1 = CMP-1500-000004-3
Q1 = CMP-1700-000042-1: MOSFET N-CH 100V 170MA SOT-23; Drain to Source Resistance: 6R; Element Configuration: Single; Fall Time: 9ns; Gate to Source Voltage (Vgs): 20V; Input Capacitance: 73pF; Max Power Dissipation: 360mW; Nominal Vgs: 1.7V; Number of Elements: 1; Turn-Off Delay Time: 17ns; Turn-On Delay Time: 1.7ns; Packaging: Tape and Reel; Case/Package: SOT-23; Contact Plating: Tin,Matte; Continuous Drain Current (ID): 170mA; Current Rating: 170mA; Drain to Source Breakdown Voltage: 100V; Drain to Source Voltage (Vdss): 100V; Dual Supply Voltage: 100V; Height: 0.93mm; Lead Free: Lead Free; Length: 2.92mm; Max Operating Temperature: 150°C; Min Operating Temperature: -55°C; Mount: Surface Mount; Number of Pins: 3; On-State Resistance: 6R; Package Quantity: 1; Power Dissipation: 360mW; Radiation Hardening: No; Rds On Max: 6R; REACH SVHC: No SVHC; Rise Time: 9ns; Threshold Voltage: 1.7V; Voltage: 100V; Voltage Rating (DC): 100V; Width: 1.3mm
R5-R10 = CMP-1800-001411-4: Thick film Chip Resistor, 0402/1005; Value: 200; Power: 100mW; Maximum working voltage: 50V; Temp. Coefficent: 0.01%; Tolerance: 1%; Case/Package: 0402/1005; Composition: Thick film
R11 = CMP-1800-002400-4: Thin film Chip Resistor, 0603/1608; Value: 4.12k; Maximum working voltage: 50V; Power: 100mW; Temp. Coefficent: 0.0015%; Tolerance: 0.1%; Case/Package: 0603/1608; Composition: Thin film
R12 = CMP-1800-002038-5: Thick film Chip Resistor, 0603/1608; Value: 5.1k; Power: 100mW; Maximum working voltage: 75V; Temp. Coefficent: 0.01%; Tolerance: 1%; Case/Package: 0603/1608; Composition: Thick film
R13 = CMP-1800-001437-4: Thick film Chip Resistor, 0402/1005; Value: 2.4k; Power: 100mW; Maximum working voltage: 50V; Temp. Coefficent: 0.01%; Tolerance: 1%; Case/Package: 0402/1005; Composition: Thick film
R14 = CMP-1800-001430-4: Thick film Chip Resistor, 0402/1005; Value: 1.2k; Power: 100mW; Maximum working voltage: 50V; Temp. Coefficent: 0.01%; Tolerance: 1%; Case/Package: 0402/1005; Composition: Thick film
R15 = CMP-1800-002010-5: Thick film Chip Resistor, 0603/1608; Value: 330; Power: 100mW; Maximum working voltage: 75V; Temp. Coefficent: 0.01%; Tolerance: 1%; Case/Package: 0603/1608; Composition: Thick film
R16 R19 = CMP-1800-001390-4: Thick film Chip Resistor, 0402/1005; Value: 27; Power: 100mW; Maximum working voltage: 50V; Temp. Coefficent: 0.01%; Tolerance: 1%; Case/Package: 0402/1005; Composition: Thick film
R17 R18 = CMP-1800-001397-4: Thick film Chip Resistor, 0402/1005; Value: 51; Power: 100mW; Maximum working voltage: 50V; Temp. Coefficent: 0.01%; Tolerance: 1%; Case/Package: 0402/1005; Composition: Thick film
T1 = CMP-2000-000004-1: Transformers Audio & Signal 4.5-3000MHz IL 2dB Impedance Ratio 1:1; Max DC Current: 30mA; Power Rating: 250mW; Case/Package: SMD/SMT; Package Quantity: 2000; Termination: SMD/SMT; Depth: 3.81mm; Max Operating Temperature: 85°C; Turns Ratio: 1:1; Length: 3.81mm; Width: 3.81mm; Radiation Hardening: No; Packaging: Tape and Reel; Min Operating Temperature: -40°C; Mount: Surface Mount; Number of Pins: 5; Height: 2.67mm; Lead Free: Contains Lead
U2 U4 U5 = CMP-2100-000562-3: Buffer/Line Driver 4-CH Non-Inverting 3-ST CMOS 14-Pin SOIC Tube; Number of Bits: 4; Min Supply Voltage: 2V; Propagation Delay: 15ns; High Level Output Current: -8mA; Quiescent Current: 4uA; Number of Bits per Element: 1; Max Supply Voltage: 5.5V; Logic Function: Buffer,Inverting; Turn-On Delay Time: 11.5ns; Low Level Output Current: 8mA; REACH SVHC: No SVHC; Max Operating Temperature: 125°C; Polarity: Non-Inverting; Case/Package: SOIC; Number of Elements: 4; Package Quantity: 50; Number of Output Lines: 4; Min Operating Temperature: -40°C; Length: 8.65mm; Mount: Surface Mount; Number of Channels: 4; Number of Pins: 14; Termination: SMD/SMT; Number of Inputs: 4; Radiation Hardening: No; Lead Free: Lead Free; Height: 1.58mm; Number of Input Lines: 4; Packaging: Rail/Tube; Width: 3.91mm; Number of Outputs: 4
U3 = CMP-2100-000590-1: IC CLOCK GEN 6CH 2.65GHZ 48LFCSP; Number of Circuits: 1; PLL: Yes; Input: CMOS; Number of Inputs: 2; Max Supply Voltage: 3.465V; Operating Supply Voltage: 3.3V; Max Supply Current: 100uA; Min Supply Voltage: 3.135V; Number of Outputs: 6; Height: 0.95mm; Min Operating Temperature: -40°C; Logic Function: Clock; Case/Package: LFCSP EP; Max Operating Temperature: 85°C; Packaging: Tray; Frequency: 2.65GHz; Width: 7.1mm; Number of Pins: 48; Radiation Hardening: No; REACH SVHC: No SVHC; Lead Free: Contains Lead; Max Frequency: 2.65GHz; Length: 7.1mm; Contact Plating: Tin,Matte
X1 = CMP-2400-000012-1: OSC TCXO 20.000MHZ LVCMOS SMD; Frequency Stability: 1ppm; Max Supply Current: 6mA; Frequency: 20MHz; Package Quantity: 250; Packaging: Tape and Reel; Case/Package: SMD/SMT; Max Operating Temperature: 85°C; Min Operating Temperature: -40°C

## Sheet [21] USB.SchDoc: USB
size 393 x 281 mm; SheetNumber: 21; SheetTotal: 21; PageSetup: Record=PageOptions|CenterHorizontal=True|CenterVertical=True|PrintScale=0.94|XCorrection=0.00|YCorrection=0.00|PrintKind=0|BorderSize=5000000|LeftOffset=0|BottomOffset=0|Orientation=2|PaperLength=1000|PaperWidth=1000|Scale=100|PaperSource=15|PrintQuality=600|MediaType=1|DitherType=10|PrintScaleMode=1|PaperKind=A4; Adr1: August Barks gata 6B; Adr2: SE-421 32 Västra Frölunda; Adr3: Sweden; Webpage: www.omnisys.se
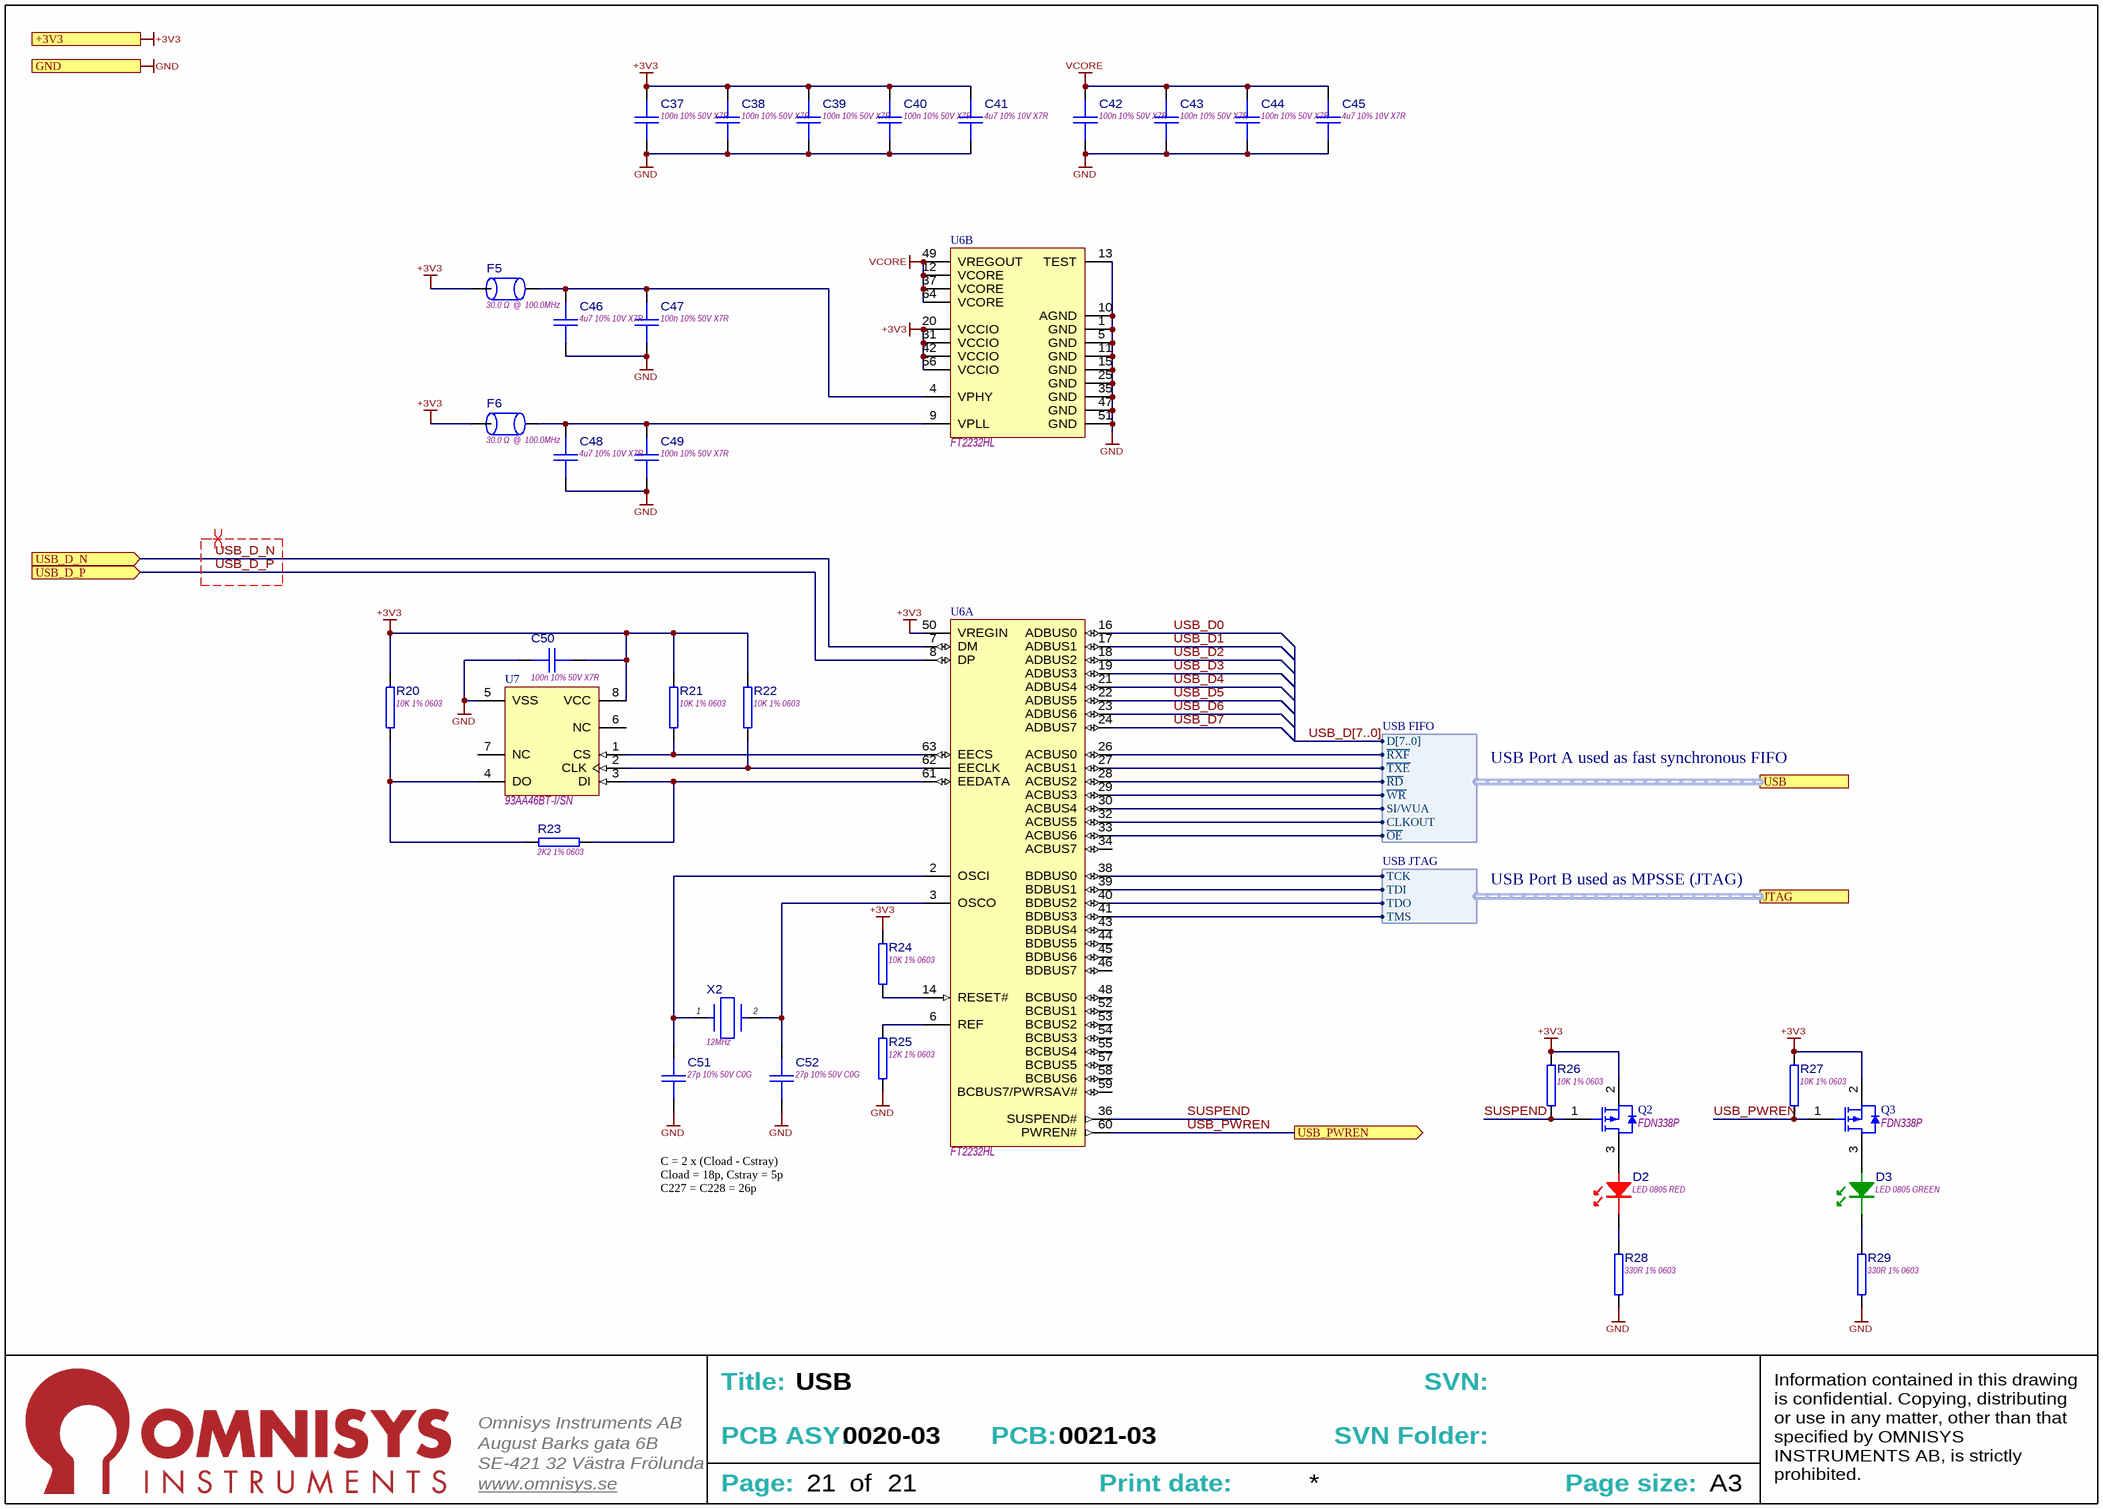
[diagram p2: [21] USB.SchDoc]

### Parts
C37  100n 10% 50V X7R  [CAPC1608X90N]
C38  100n 10% 50V X7R  [CAPC1608X90N]
C39  100n 10% 50V X7R  [CAPC1608X90N]
C40  100n 10% 50V X7R  [CAPC1608X90N]
C41  4u7 10% 10V X7R  [CAPC2012X145N]
C42  100n 10% 50V X7R  [CAPC1608X90N]
C43  100n 10% 50V X7R  [CAPC1608X90N]
C44  100n 10% 50V X7R  [CAPC1608X90N]
C45  4u7 10% 10V X7R  [CAPC2012X145N]
C46  4u7 10% 10V X7R  [CAPC2012X145N]
C47  100n 10% 50V X7R  [CAPC1608X90N]
C48  4u7 10% 10V X7R  [CAPC2012X145N]
C49  100n 10% 50V X7R  [CAPC1608X90N]
C50  100n 10% 50V X7R  [CAPC1608X90N]
C51  27p 10% 50V C0G  [CAPC1608X90N]
C52  27p 10% 50V C0G  [CAPC1608X90N]
D2  LED 0805 RED  [LED2012-RED]
D3  LED 0805 GREEN  [LED2012-GREEN]
F5  30.0 Ω  @  100.0MHz  [INDC2012X11N]
F6  30.0 Ω  @  100.0MHz  [INDC2012X11N]
Q2  FDN338P  [SOT95P230X110-3N]
Q3  FDN338P  [SOT95P230X110-3N]
R20  10K 1% 0603  [RESC1608N]
R21  10K 1% 0603  [RESC1608N]
R22  10K 1% 0603  [RESC1608N]
R23  2K2 1% 0603  [RESC1608N]
R24  10K 1% 0603  [RESC1608N]
R25  12K 1% 0603  [RESC1608N]
R26  10K 1% 0603  [RESC1608N]
R27  10K 1% 0603  [RESC1608N]
R28  330R 1% 0603  [RESC1608N]
R29  330R 1% 0603  [RESC1608N]
U6  FT2232HL  [FTDI-LQFP-64_L]  (parts A,B of 2)
U7  93AA46BT-I/SN  [SOIC127P600X175-8N]
X2  12MHz  [XTAL_5x3.2MM]

### Ports
+3V3, GND, JTAG (harness USB JTAG), USB (harness USB FIFO), USB_D_N (in), USB_D_P (in), USB_PWREN (out)

### Harnesses
USB JTAG: TCK, TDI, TDO, TMS
USB FIFO: D[7..0], ~{RXF}, ~{TXE}, ~{RD}, ~{WR}, SI/WUA, CLKOUT, ~{OE}

### Nets
+3V3: C37.1 C38.1 C39.1 C40.1 C41.2 C50.2 F5.1 F6.1 Q2.2(SOURCE) Q3.2(SOURCE) R20.2 R21.2 R22.2 R24.1 R26.2 R27.2 U6.20(VCCIO) U6.31(VCCIO) U6.42(VCCIO) U6.50(VREGIN) U6.56(VCCIO) U7.8(VCC) ; port +3V3
GND: C37.2 C38.2 C39.2 C40.2 C41.1 C42.2 C43.2 C44.2 C45.1 C46.1 C47.1 C48.1 C49.1 C50.1 C51.1 C52.1 R25.1 R28.1 R29.1 U6.1(GND) U6.5(GND) U6.10(AGND) U6.11(GND) U6.13(TEST) U6.15(GND) U6.25(GND) U6.35(GND) U6.47(GND) U6.51(GND) U7.5(VSS) ; port GND
VCORE: C42.1 C43.1 C44.1 C45.2 U6.12(VCORE) U6.37(VCORE) U6.49(VREGOUT) U6.64(VCORE)
JTAG.TCK: U6.38(BDBUS0) ; port JTAG.TCK
JTAG.TDI: U6.39(BDBUS1) ; port JTAG.TDI
JTAG.TDO: U6.40(BDBUS2) ; port JTAG.TDO
JTAG.TMS: U6.41(BDBUS3) ; port JTAG.TMS
SUSPEND: Q2.1(GATE) R26.1 U6.36(SUSPEND#)
USB~{.}OE: U6.33(ACBUS6) ; port USB.~{OE}
USB~{.}RD: U6.28(ACBUS2) ; port USB.~{RD}
USB~{.}RXF: U6.26(ACBUS0) ; port USB.~{RXF}
USB~{.}TXE: U6.27(ACBUS1) ; port USB.~{TXE}
USB~{.}WR: U6.29(ACBUS3) ; port USB.~{WR}
USB.CLKOUT: U6.32(ACBUS5) ; port USB.CLKOUT
USB.SI/WUA: U6.30(ACBUS4) ; port USB.SI/WUA
USB_D0: U6.16(ADBUS0)
USB_D1: U6.17(ADBUS1)
USB_D2: U6.18(ADBUS2)
USB_D3: U6.19(ADBUS3)
USB_D4: U6.21(ADBUS4)
USB_D5: U6.22(ADBUS5)
USB_D6: U6.23(ADBUS6)
USB_D7: U6.24(ADBUS7)
USB_D_N: U6.7(DM) ; port USB_D_N
USB_D_P: U6.8(DP) ; port USB_D_P
USB_PWREN: Q3.1(GATE) R27.1 U6.60(PWREN#) ; port USB_PWREN
NetC46_2: C46.2 C47.2 F5.2 U6.4(VPHY)
NetC48_2: C48.2 C49.2 F6.2 U6.9(VPLL)
NetC51_2: C51.2 U6.2(OSCI) X2.1
NetC52_2: C52.2 U6.3(OSCO) X2.2
NetD2_1: D2.1 R28.2
NetD2_2: D2.2 Q2.3(DRAIN)
NetD3_1: D3.1 R29.2
NetD3_2: D3.2 Q3.3(DRAIN)
NetR20_1: R20.1 R23.1 U7.4(DO)
NetR21_1: R21.1 U6.63(EECS) U7.1(CS)
NetR22_1: R22.1 U6.62(EECLK) U7.2(CLK)
NetR23_2: R23.2 U6.61(EEDATA) U7.3(DI)
NetR24_2: R24.2 U6.14(RESET#)
NetR25_2: R25.2 U6.6(REF)

Not connected (* = marked no-connect by the designer): U6 34(ACBUS7) 43(BDBUS4) 44(BDBUS5) 45(BDBUS6) 46(BDBUS7) 48(BCBUS0) 52(BCBUS1) 53(BCBUS2) 54(BCBUS3) 55(BCBUS4) 57(BCBUS5) 58(BCBUS6) 59(BCBUS7/PWRSAV#); U7 6(NC) 7(NC)

### Buses and harness runs
bus USB_D[7..0]

### Layout directives
differential pair; rule Differential Pairs Routing [Pref Gap = 0.1mm    Min Gap  = 0.1mm    Max Gap  = 0.1mmPref Width = 0.1mm    Min Width  = 0.1mm    Max Width  = 0.1mm]; net class Diffpairs_USB: USB_D_N, USB_D_P

### Notes on the sheet
- USB Port A used as fast synchronous FIFO
- USB Port B used as MPSSE (JTAG)
- C = 2 x (Cload - Cstray)
  Cload = 18p, Cstray = 5p
  C227 = C228 = 26p
- Title:
- SVN:
- August Barks gata 6B
- SE-421 32 Västra Frölunda
- Omnisys Instruments AB
- PCB ASY:
- PCB:
- SVN Folder:
- www.omnisys.se
- Page:
- of
- Print date:
- Page size:
- A3
- Information contained in this drawing is confidential. Copying, distributing or use in any matter, other than that specified by OMNISYS INSTRUMENTS AB, is strictly prohibited.

### Library data of the parts
C37-C40 C42-C44 C47 C49 C50 = CMP-0300-002665-6: as C8 on sheet [6] CLOCK; Package: 1608/0603; Temperature Charateristics: X7R; Tolerance: 10%; Rated Voltage: 50V; Thickness: 900µm; Weight: 9mg
C41 C45 C46 C48 = CMP-0300-003983-5: Ceramic Chip Capacitor, 0805/2012; Capacitance: 4.7µF; Package: 2012/0805; Temperature Charateristics: X7R; Tolerance: 10%; Thickness: 1.4mm; Rated Voltage: 10V
C51 C52 = CMP-0300-002442-6: Ceramic Chip Capacitor, 0603/1608; Tolerance: 5%; Capacitance: 27pF; Package: 1608/0603; Temperature Charateristics: C0G; Rated Voltage: 50V; Thickness: 900µm; Weight: 9mg
D2 = CMP-1500-000001-3
D3 = CMP-1500-000004-3
F5 F6 = CMP-0600-000010-2: as F3 on sheet [1] 0020-03_FFT2G - Top; Z@Freq: 30.0 Ω  @  100.0MHz; PartNumber: 74279206
Q2 Q3 = CMP-1700-000037-1: ON SEMICONDUCTOR - FDN338P - P CHANNEL MOSFET, -20V, 1.6A SUPER SOT-3; Drain to Source Voltage (Vdss): 20V; Current Rating: -1.6A; Drain to Source Resistance: 115mR; Element Configuration: Single; Fall Time: 11ns; Gate to Source Voltage (Vgs): 8V; Input Capacitance: 451pF; Max Power Dissipation: 460mW; Nominal Vgs: -800mV; Number of Elements: 1; Power Dissipation: 500mW; RDS(on): 0.115; Turn-Off Delay Time: 16ns; Turn-On Delay Time: 10ns; Packaging: Tape and Reel; Case/Package: TO-236-3; Contact Plating: Tin,Matte; Continuous Drain Current (ID): 1.6A; Drain to Source Breakdown Voltage: -20V; Lead Free: Lead Free; Max Operating Temperature: 150°C; Min Operating Temperature: -55°C; Mount: Surface Mount; Number of Pins: 3; On-State Resistance: 115mR; Package Quantity: 3000; PartNumber: FDN338P; Radiation Hardening: No; Rds On Max: 115mR; REACH SVHC: No SVHC; Rise Time: 11ns; Threshold Voltage: -800mV; Voltage Rating (DC): -20V; Weight: 0.03g
R20-R22 R24 R26 R27 = CMP-1800-002045-5: Thick film Chip Resistor, 0603/1608; Power: 100mW; Maximum working voltage: 75V; Temp. Coefficent: 0.01%; Value: 10k; Tolerance: 1%; Case/Package: 0603/1608; Composition: Thick film
R23 = CMP-1800-002029-5: Thick film Chip Resistor, 0603/1608; Value: 2.2k; Power: 100mW; Maximum working voltage: 75V; Temp. Coefficent: 0.01%; Tolerance: 1%; Case/Package: 0603/1608; Composition: Thick film
R25 = CMP-1800-002047-5: Thick film Chip Resistor, 0603/1608; Power: 100mW; Maximum working voltage: 75V; Temp. Coefficent: 0.01%; Value: 12k; Tolerance: 1%; Case/Package: 0603/1608; Composition: Thick film
R28 R29 = CMP-1800-002010-5: as R15 on sheet [6] CLOCK; Tolerance: 1%; Case/Package: 0603/1608; Composition: Thick film
U6 = CMP-2100-000591-1: FTDI Chip FT2232HL Dual UART Interface RS232, RS422, RS485 480Mbit/s, 64-Pin, LQFP; Length: 10mm; Width: 10mm; Height: 1.4mm; Case/Package: LQFP; Lead Free: Lead Free; Max Operating Temperature: 85°C; Min Operating Temperature: -40°C; Mount: Surface Mount; Number of Pins: 64
U7 = CMP-2100-000589-1: IC EEPROM 1KBIT 2MHZ 8SOIC; Access Time: 250ns; Density: 1Kb; Interface: Serial; Max Frequency: 1MHz; Max Supply Voltage: 5.5V; Min Supply Voltage: 1.8V; Nominal Supply Current: 2mA; Case/Package: SOIC; Frequency: 2MHz; Lead Free: Lead Free; Max Operating Temperature: 85°C; Memory Size: 1Kb; Memory Type: EEPROM; Min Operating Temperature: -40°C; Mount: Surface Mount; Number of Pins: 8; Package Quantity: 3300; Packaging: Tape and Reel; Radiation Hardening: No
X2 = CMP-2400-000025-1: 12MHz 5 x 3.2 mm SMD GLASS CRYSTAL; ESR (Equivalent Series Resistance): 80R; Frequency Stability: 30ppm; Load Capacitance: 12pF; Case/Package: SMD/SMT; Depth: 3.2mm; Frequency: 12MHz; Frequency Tolerance: 30ppm; Height: 0.053inch; Lead Free: Contains Lead; Length: 5mm; Max Operating Temperature: 85°C; Min Operating Temperature: -40°C; Mount: Surface Mount; Number of Pins: 2; Package Quantity: 1; Packaging: Tape and Reel; Series Resistance: 80R; Width: 0.126inch

## Sheet [8] FPGA.SchDoc: FPGA
size 393 x 281 mm; SheetNumber: 8; SheetTotal: 21; PageSetup: Record=PageOptions|CenterHorizontal=True|CenterVertical=True|PrintScale=0.94|XCorrection=0.00|YCorrection=0.00|PrintKind=0|BorderSize=5000000|LeftOffset=0|BottomOffset=0|Orientation=2|PaperLength=1000|PaperWidth=1000|Scale=100|PaperSource=15|PrintQuality=600|MediaType=1|DitherType=10|PrintScaleMode=1|PaperKind=A4; Adr1: August Barks gata 6B; Adr2: SE-421 32 Västra Frölunda; Adr3: Sweden; Webpage: www.omnisys.se
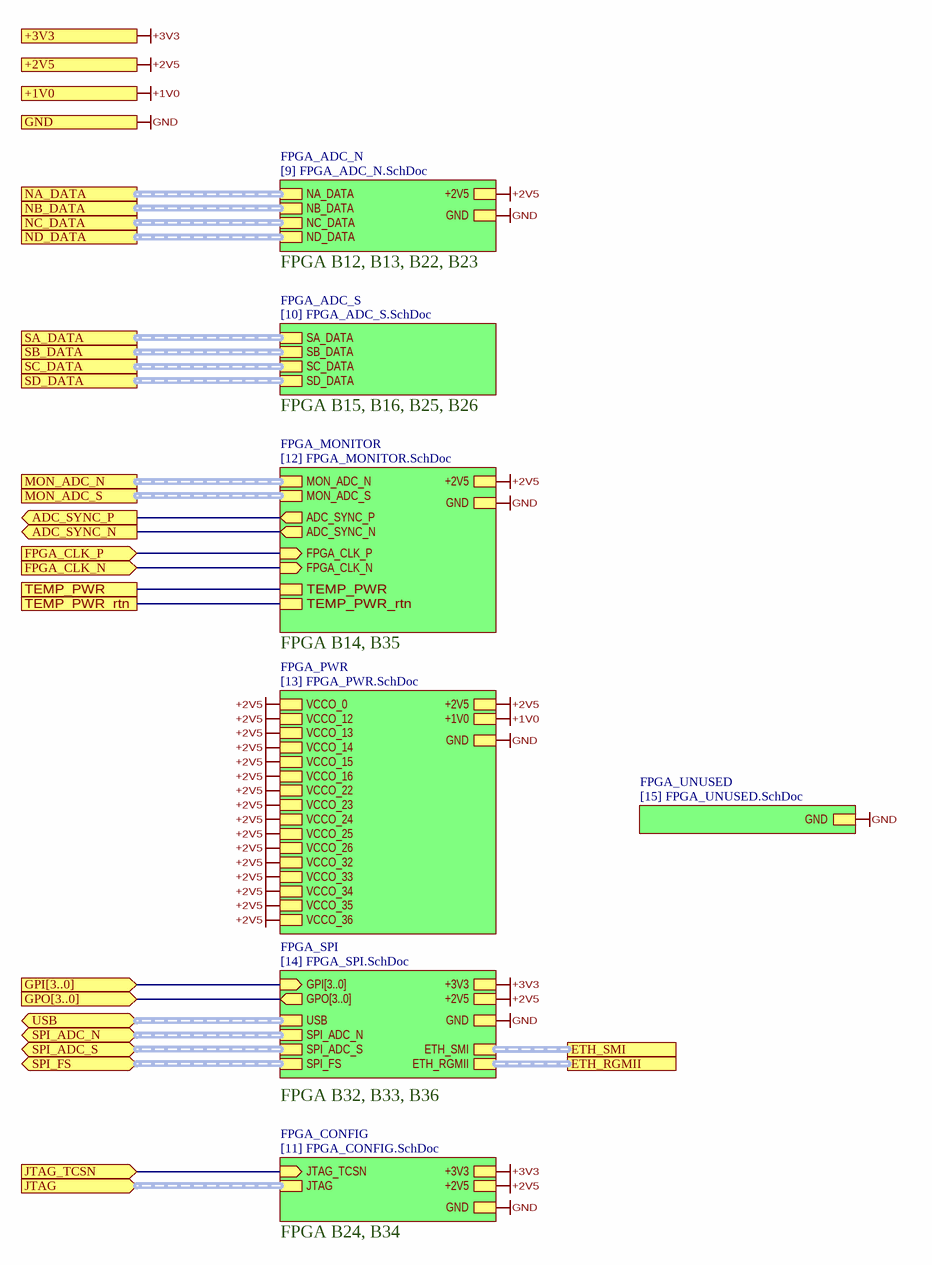
[diagram p3: [8] FPGA.SchDoc]

### Sub-sheets
FPGA_ADC_N = [9] FPGA_ADC_N.SchDoc: NA_DATA (harness ADC Port), NC_DATA (harness ADC Port), ND_DATA (harness ADC Port), NB_DATA (harness ADC Port), GND, +2V5
FPGA_ADC_S = [10] FPGA_ADC_S.SchDoc: SA_DATA (harness ADC Port), SC_DATA (harness ADC Port), SD_DATA (harness ADC Port), SB_DATA (harness ADC Port)
FPGA_CONFIG = [11] FPGA_CONFIG.SchDoc: JTAG_TCSN (in), JTAG (harness USB JTAG), GND, +2V5, +3V3
FPGA_MONITOR = [12] FPGA_MONITOR.SchDoc: MON_ADC_N (harness MON_ADC), MON_ADC_S (harness MON_ADC), FPGA_CLK_P (in), FPGA_CLK_N (in), ADC_SYNC_P (out), ADC_SYNC_N (out), +2V5, GND, TEMP_PWR_rtn, TEMP_PWR
FPGA_PWR = [13] FPGA_PWR.SchDoc (file not in this document): VCCO_36, +2V5, VCCO_12, VCCO_13, VCCO_14, VCCO_15, VCCO_16, VCCO_22, VCCO_23, VCCO_24, VCCO_25, VCCO_26, VCCO_32, VCCO_33, VCCO_34, VCCO_35, +1V0, GND, VCCO_0
FPGA_SPI = [14] FPGA_SPI.SchDoc (file not in this document): USB (harness USB FIFO), SPI_ADC_N (harness SPI_ADC), SPI_ADC_S (harness SPI_ADC), SPI_FS (harness SPI_FS), GPI[3..0] (in), +3V3, GND, +2V5, ETH_SMI (harness ETH_SMI), ETH_RGMII (harness ETH_RGMII), GPO[3..0] (out)
FPGA_UNUSED = [15] FPGA_UNUSED.SchDoc: GND

### Ports
+1V0, +2V5, +3V3, ADC_SYNC_N (out), ADC_SYNC_P (out), ETH_RGMII (harness ETH_RGMII), ETH_SMI (harness ETH_SMI), FPGA_CLK_N (in), FPGA_CLK_P (in), GND, GPI[3..0] (in), GPO[3..0] (in), JTAG (in, harness USB JTAG), JTAG_TCSN (in), MON_ADC_N (harness MON_ADC), MON_ADC_S (harness MON_ADC), NA_DATA (harness ADC Port), NB_DATA (harness ADC Port), NC_DATA (harness ADC Port), ND_DATA (harness ADC Port), SA_DATA (harness ADC Port), SB_DATA (harness ADC Port), SC_DATA (harness ADC Port), SD_DATA (harness ADC Port), SPI_ADC_N (bidir, harness SPI_ADC), SPI_ADC_S (bidir, harness SPI_ADC), SPI_FS (bidir, harness SPI_FS), TEMP_PWR, TEMP_PWR_rtn, USB (bidir, harness USB FIFO)

### Nets
+1V0: port +1V0, sheet FPGA_PWR/+1V0
+2V5: port +2V5, sheet FPGA_PWR/VCCO_36, sheet FPGA_PWR/+2V5, sheet FPGA_PWR/VCCO_12, sheet FPGA_PWR/VCCO_13, sheet FPGA_PWR/VCCO_14, sheet FPGA_PWR/VCCO_15, sheet FPGA_PWR/VCCO_16, sheet FPGA_PWR/VCCO_22, sheet FPGA_PWR/VCCO_23, sheet FPGA_PWR/VCCO_24, sheet FPGA_PWR/VCCO_25, sheet FPGA_PWR/VCCO_26, sheet FPGA_PWR/VCCO_32, sheet FPGA_PWR/VCCO_33, sheet FPGA_PWR/VCCO_34, sheet FPGA_PWR/VCCO_35, sheet FPGA_PWR/VCCO_0, sheet FPGA_ADC_N/+2V5, sheet FPGA_SPI/+2V5, sheet FPGA_MONITOR/+2V5, sheet FPGA_CONFIG/+2V5
+3V3: port +3V3, sheet FPGA_SPI/+3V3, sheet FPGA_CONFIG/+3V3
GND: port GND, sheet FPGA_PWR/GND, sheet FPGA_ADC_N/GND, sheet FPGA_SPI/GND, sheet FPGA_MONITOR/GND, sheet FPGA_UNUSED/GND, sheet FPGA_CONFIG/GND
ADC_SYNC_N: port ADC_SYNC_N, sheet FPGA_MONITOR/ADC_SYNC_N
ADC_SYNC_P: port ADC_SYNC_P, sheet FPGA_MONITOR/ADC_SYNC_P
FPGA_CLK_N: port FPGA_CLK_N, sheet FPGA_MONITOR/FPGA_CLK_N
FPGA_CLK_P: port FPGA_CLK_P, sheet FPGA_MONITOR/FPGA_CLK_P
TEMP_PWR: port TEMP_PWR, sheet FPGA_MONITOR/TEMP_PWR
TEMP_PWR_rtn: port TEMP_PWR_rtn, sheet FPGA_MONITOR/TEMP_PWR_rtn
USB_PWREN: port JTAG_TCSN, sheet FPGA_CONFIG/JTAG_TCSN

### Buses and harness runs
bus port GPI[3..0] = sheet FPGA_SPI/GPI[3..0]
bus port GPO[3..0] = sheet FPGA_SPI/GPO[3..0]
harness port ETH_RGMII = sheet FPGA_SPI/ETH_RGMII
harness port ETH_SMI = sheet FPGA_SPI/ETH_SMI
harness port JTAG = sheet FPGA_CONFIG/JTAG
harness port MON_ADC_N = sheet FPGA_MONITOR/MON_ADC_N
harness port MON_ADC_S = sheet FPGA_MONITOR/MON_ADC_S
harness port NA_DATA = sheet FPGA_ADC_N/NA_DATA
harness port NB_DATA = sheet FPGA_ADC_N/NB_DATA
harness port NC_DATA = sheet FPGA_ADC_N/NC_DATA
harness port ND_DATA = sheet FPGA_ADC_N/ND_DATA
harness port SA_DATA = sheet FPGA_ADC_S/SA_DATA
harness port SB_DATA = sheet FPGA_ADC_S/SB_DATA
harness port SC_DATA = sheet FPGA_ADC_S/SC_DATA
harness port SD_DATA = sheet FPGA_ADC_S/SD_DATA
harness port SPI_ADC_N = sheet FPGA_SPI/SPI_ADC_N
harness port SPI_ADC_S = sheet FPGA_SPI/SPI_ADC_S
harness port SPI_FS = sheet FPGA_SPI/SPI_FS
harness port USB = sheet FPGA_SPI/USB

### Notes on the sheet
- FPGA B12, B13, B22, B23
- FPGA B15, B16, B25, B26
- FPGA B14, B35
- FPGA B32, B33, B36
- FPGA B24, B34
- Title:
- SVN:
- August Barks gata 6B
- SE-421 32 Västra Frölunda
- Omnisys Instruments AB
- PCB ASY:
- PCB:
- SVN Folder:
- www.omnisys.se
- Page:
- of
- Print date:
- Page size:
- A3
- Information contained in this drawing is confidential. Copying, distributing or use in any matter, other than that specified by OMNISYS INSTRUMENTS AB, is strictly prohibited.